# EAGLE design Validation (EAGLE 9.5.2)
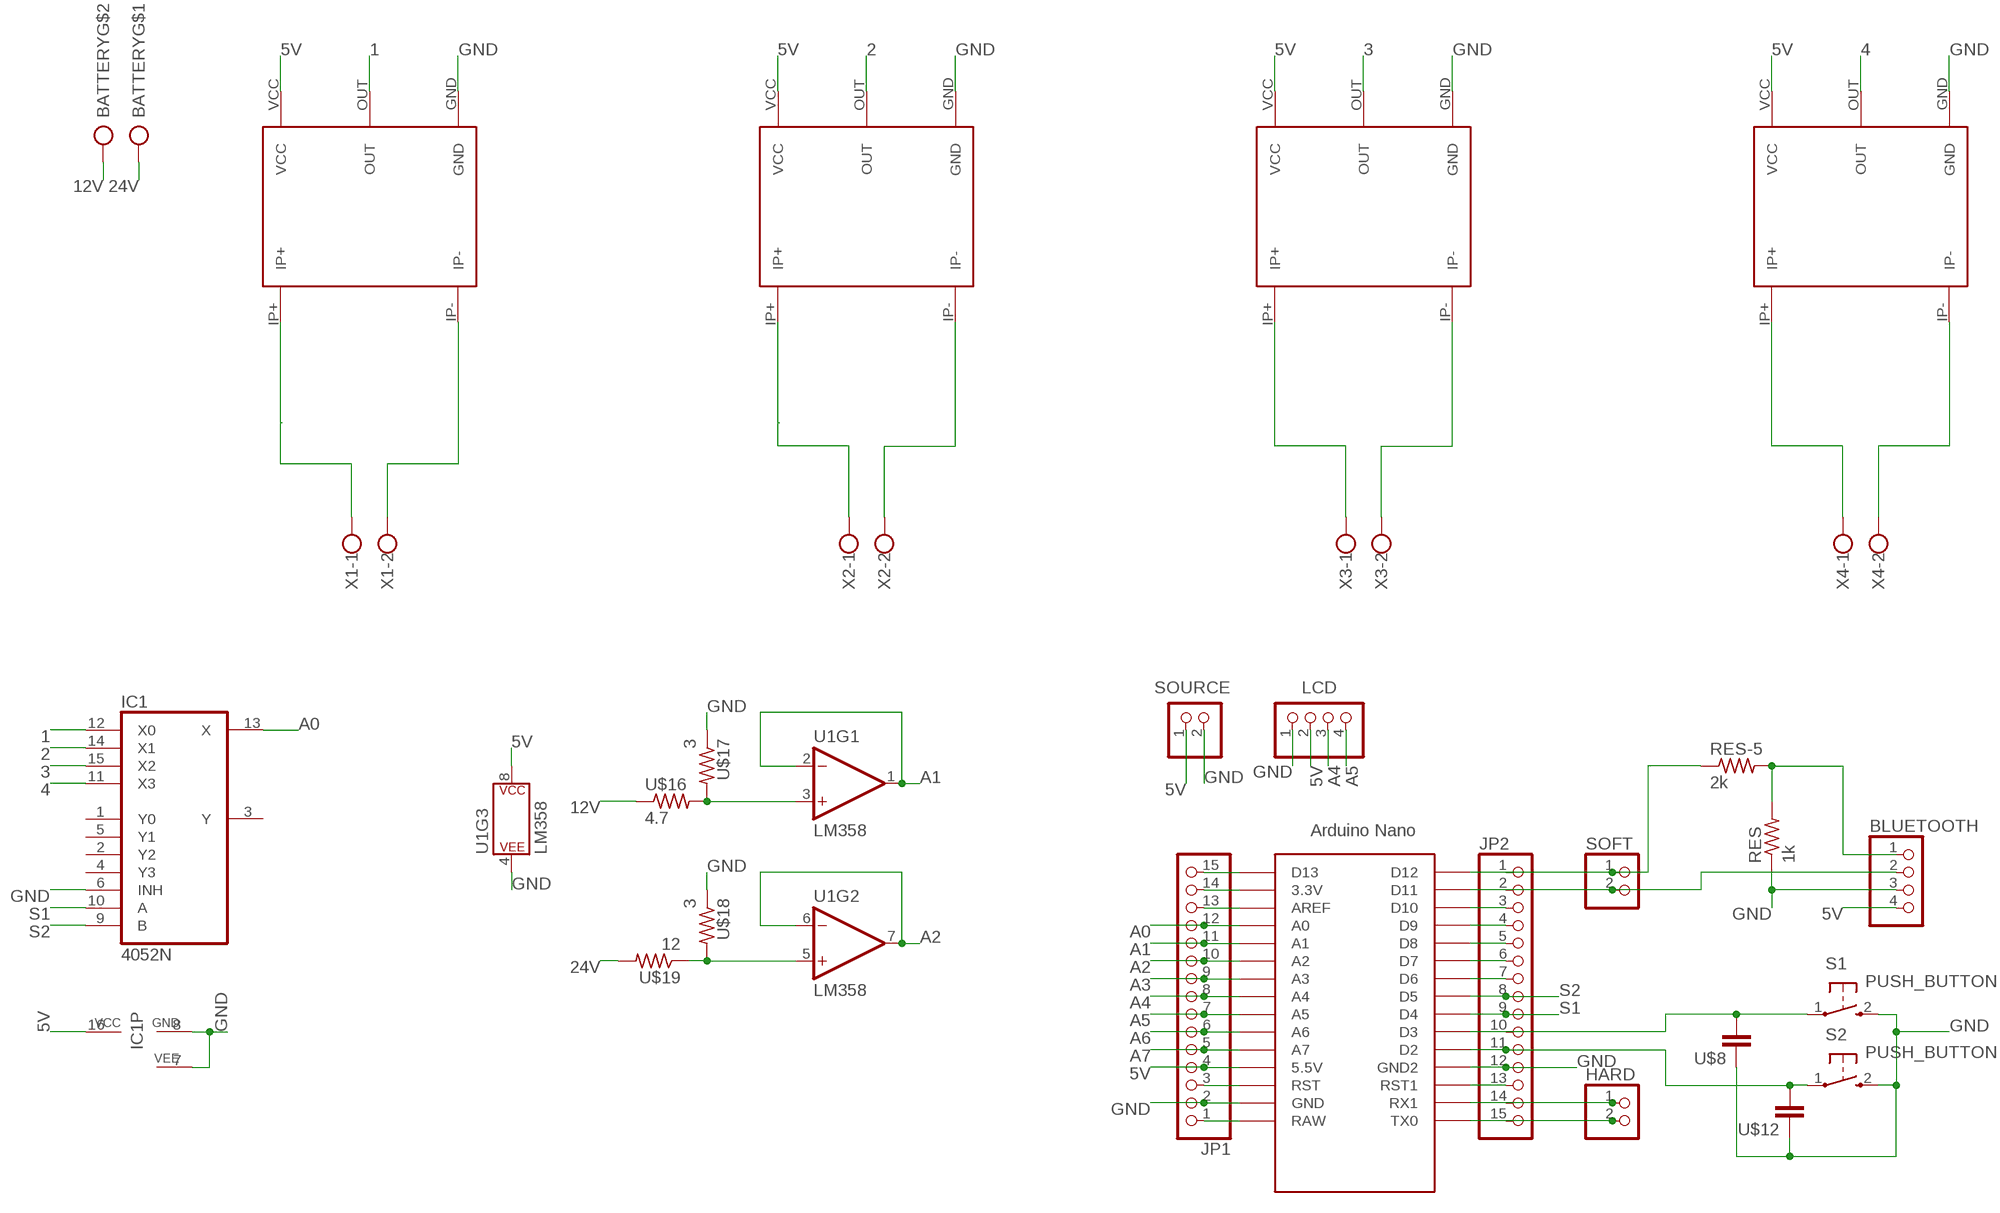
[diagram p0: schematic, sheet 1]

## Parts
BATTERY  CON_PTR_2  [AK300/2]
BLUETOOTH  PINHD-4_DATA  [1X04_DATA]
HARD  PINHD-2_DATA  [1X02_DATA]
IC1  4052N  [DIL16]
JP1  PINHD-1X15  [1X15]
JP2  PINHD-1X15  [1X15]
LCD  PINHD-4_DATA  [1X04_DATA]
RES  1k  RES-5  [0204/5]
RES-5  2k  RES-5  [0204/5]
S1  PUSH_BUTTON  [B3F-10XX]
S2  PUSH_BUTTON  [B3F-10XX]
SOFT  PINHD-2_DATA  [1X02_DATA]
SOURCE  PINHD-2_DATA  [1X02_DATA]
U1  LM358  [DIP08]
U$1  ASC712_MODULE  [ASC712_MODULE]
U$4  ARDUINO_NANO  [NANO]
U$5  ASC712_MODULE  [ASC712_MODULE]
U$8  CAPACITOR  [C025-025X050]
U$9  ASC712_MODULE  [ASC712_MODULE]
U$12  CAPACITOR  [C025-025X050]
U$13  ASC712_MODULE  [ASC712_MODULE]
U$16  4.7  RES-7  [0204/7]
U$17  3  RES-7  [0204/7]
U$18  3  RES-7  [0204/7]
U$19  12  RES-7  [0204/7]
X1  ROSTA.POWER  [W239-302]
X2  ROSTA.POWER  [W239-302]
X3  ROSTA.POWER  [W239-302]
X4  ROSTA.POWER  [W239-302]

## Nets
1: IC1.12(X0) U$1.OUT
2: IC1.14(X1) U$5.OUT
3: IC1.15(X2) U$9.OUT
4: IC1.11(X3) U$13.OUT
5V: BLUETOOTH.4 IC1.16(VCC) JP1.4 LCD.2 SOURCE.1 U1.8(P$V+) U$1.VCC U$4.5V(5.5V) U$5.VCC U$9.VCC U$13.VCC
12V: BATTERY.2 U$16.1
24V: BATTERY.1 U$19.2
A0: IC1.13(X) JP1.12 U$4.A0
A1: JP1.11 U1.1(OUT) U1.2(-IN) U$4.A1
A2: JP1.10 U1.6(-IN) U1.7(OUT) U$4.A2
A3: JP1.9 U$4.A3
A4: JP1.8 LCD.3 U$4.A4
A5: JP1.7 LCD.4 U$4.A5
A6: JP1.6 U$4.A6
A7: JP1.5 U$4.A7
GND: BLUETOOTH.3 IC1.6(INH) IC1.7(VEE) IC1.8(GND) JP1.2 JP2.12 LCD.1 RES.1 S1.2(S) S2.2(S) SOURCE.2 U1.4(P$V-) U$1.GND U$4.GND U$4.GND1(GND2) U$5.GND U$8.1 U$9.GND U$12.1 U$13.GND U$17.1 U$18.1
N$2: U$1.IP+ X1.1
N$3: JP1.1 U$4.RAW
N$4: U$1.IP- X1.2
N$6: U$5.IP+ X2.1
N$7: U$5.IP- X2.2
N$8: U$13.IP- X4.2
N$10: U$9.IP+ X3.1
N$11: U$9.IP- X3.2
N$12: U1.3(+IN) U$16.2 U$17.2
N$14: U$13.IP+ X4.1
N$15: JP1.3 U$4.RST
N$16: BLUETOOTH.1 RES-5.2 RES.2
N$21: U1.5(+IN) U$18.2 U$19.1
N$27: JP1.13 U$4.AREF
N$28: JP1.14 U$4.3.3V
N$29: JP1.15 U$4.D13
N$30: JP2.1 RES-5.1 SOFT.1 U$4.D12
N$31: BLUETOOTH.2 JP2.2 SOFT.2 U$4.D11
N$32: JP2.3 U$4.D10
N$33: JP2.4 U$4.D9
N$34: JP2.5 U$4.D8
N$35: JP2.6 U$4.D7
N$36: JP2.7 U$4.D6
N$39: JP2.10 S1.1(P) U$4.D3 U$8.2
N$40: JP2.11 S2.1(P) U$4.D2 U$12.2
N$42: JP2.13 U$4.RST1
N$43: HARD.1 JP2.14 U$4.RX1
N$44: HARD.2 JP2.15 U$4.TX0
S1: IC1.10(A) JP2.9 U$4.D4
S2: IC1.9(B) JP2.8 U$4.D5
Unconnected: IC1.1(Y0) IC1.2(Y2) IC1.3(Y) IC1.4(Y3) IC1.5(Y1)

## Library data of the parts
BATTERY = MIA_LIBRARY-2-2-2:CON_PTR_2
BLUETOOTH LCD = MIA_LIBRARY-2-2-2:PINHD-4_DATA: PIN HEADER
HARD SOFT SOURCE = MIA_LIBRARY-2-2-2:PINHD-2_DATA: PIN HEADER
IC1 = 40xx:4052: Dual 4-channel ANALOG MULTIPLEXER
JP1 JP2 = pinhead:PINHD-1X15: PIN HEADER
RES RES-5 = MIA_LIBRARY-2-2-2:RES-5
S1 S2 = MIA_LIBRARY-2-2-2:PUSH_BUTTON: OMRON SWITCH
U1 = MIA_LIBRARY-2-2-2:LM358: LM358 Jellybean op-amp Datasheet <http://www.sparkfun.com/datasheets/Components/General/LM358.pdf> SparkFun Products Op-Amp (Thru-Hole) - LM358 <https://www.sparkfun.com/products/9456> (COM-09456); PROD_ID: IC-09172
U$1 U$5 U$9 U$13 = MIA_LIBRARY-2-2-2:ASC712_MODULE
U$4 = MIA_LIBRARY-2-2-2:ARDUINO_NANO: Arduino Nano
U$8 U$12 = MIA_LIBRARY-2-2-2:CAPACITOR
U$16-U$19 = MIA_LIBRARY-2-2-2:RES-7
X1-X4 = MIA_LIBRARY-2-2-2:ROSTA.POWER: WAGO SCREW CLAMP; OC_FARNELL: unknown; OC_NEWARK: unknown

## Board
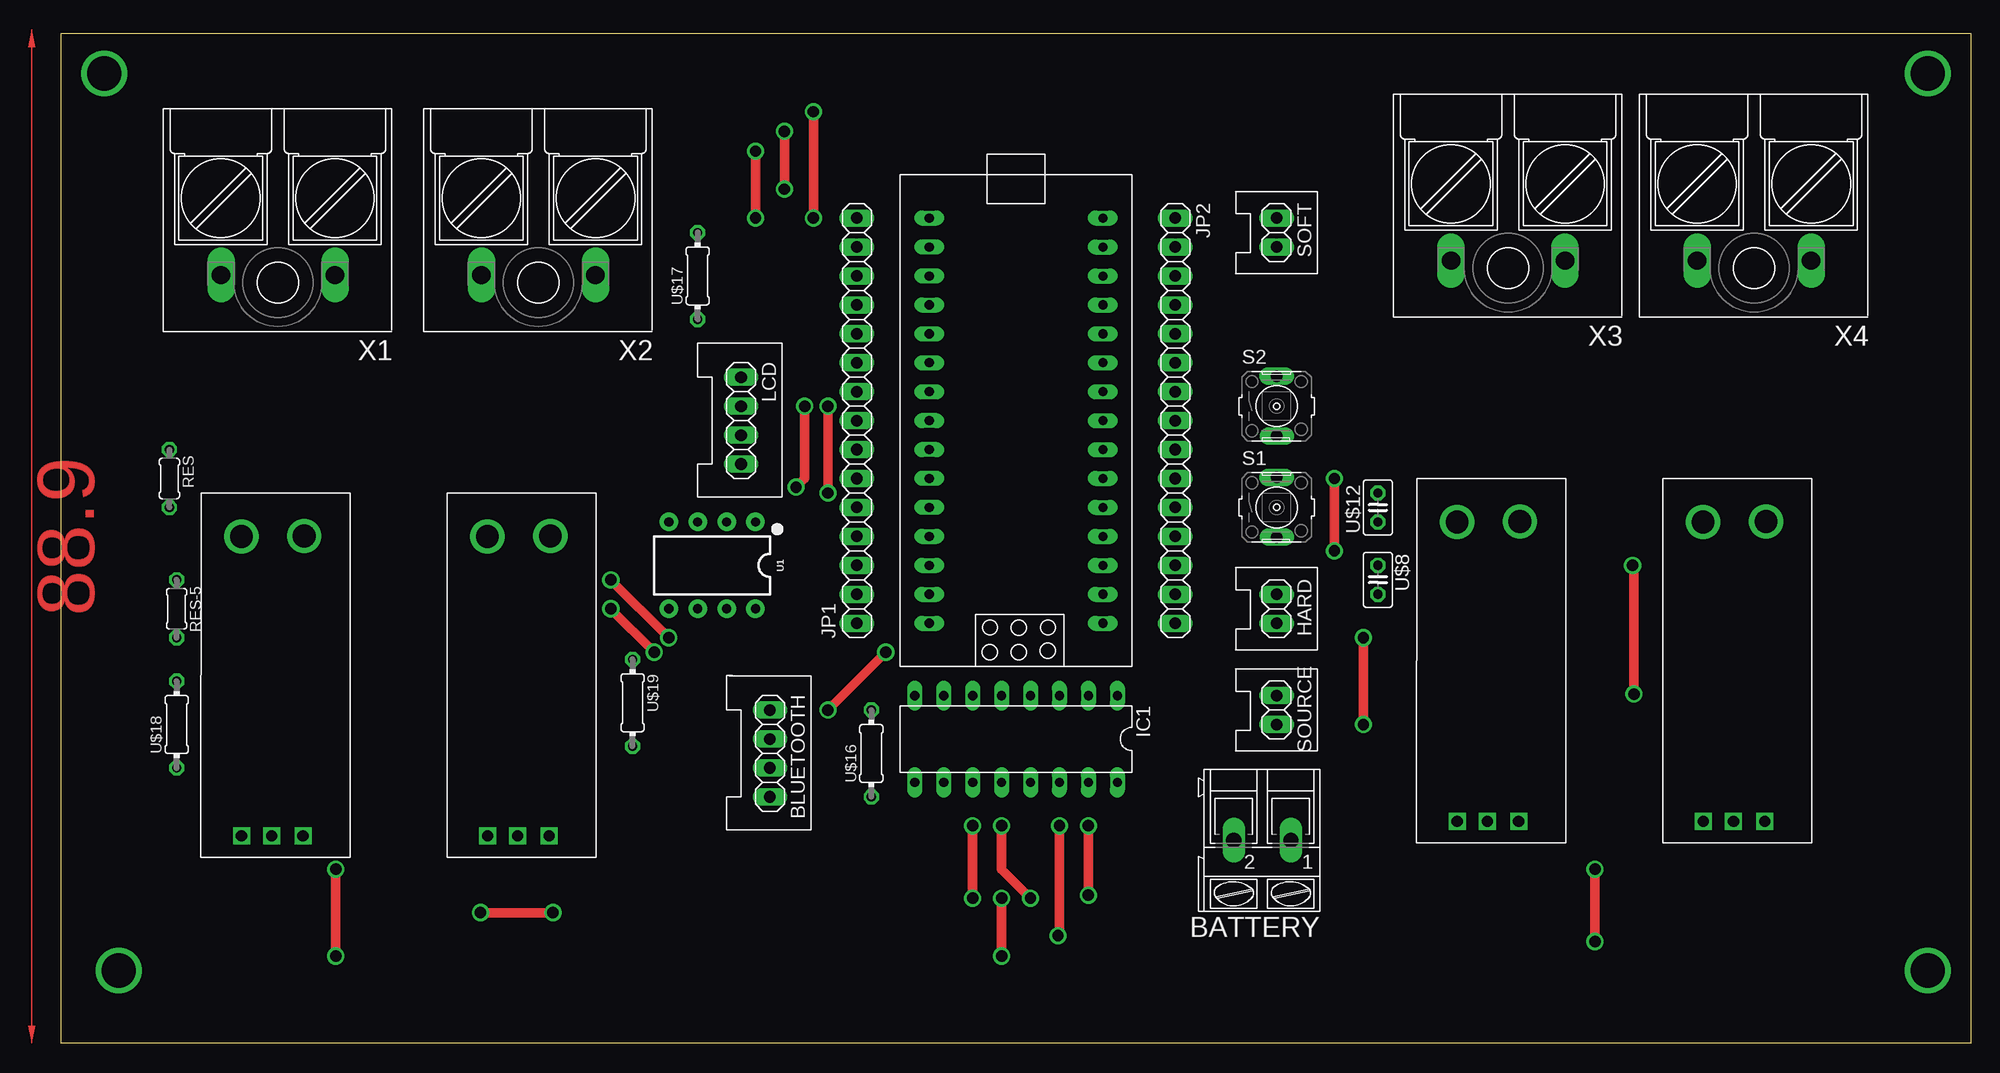
[diagram p1: board, top side]
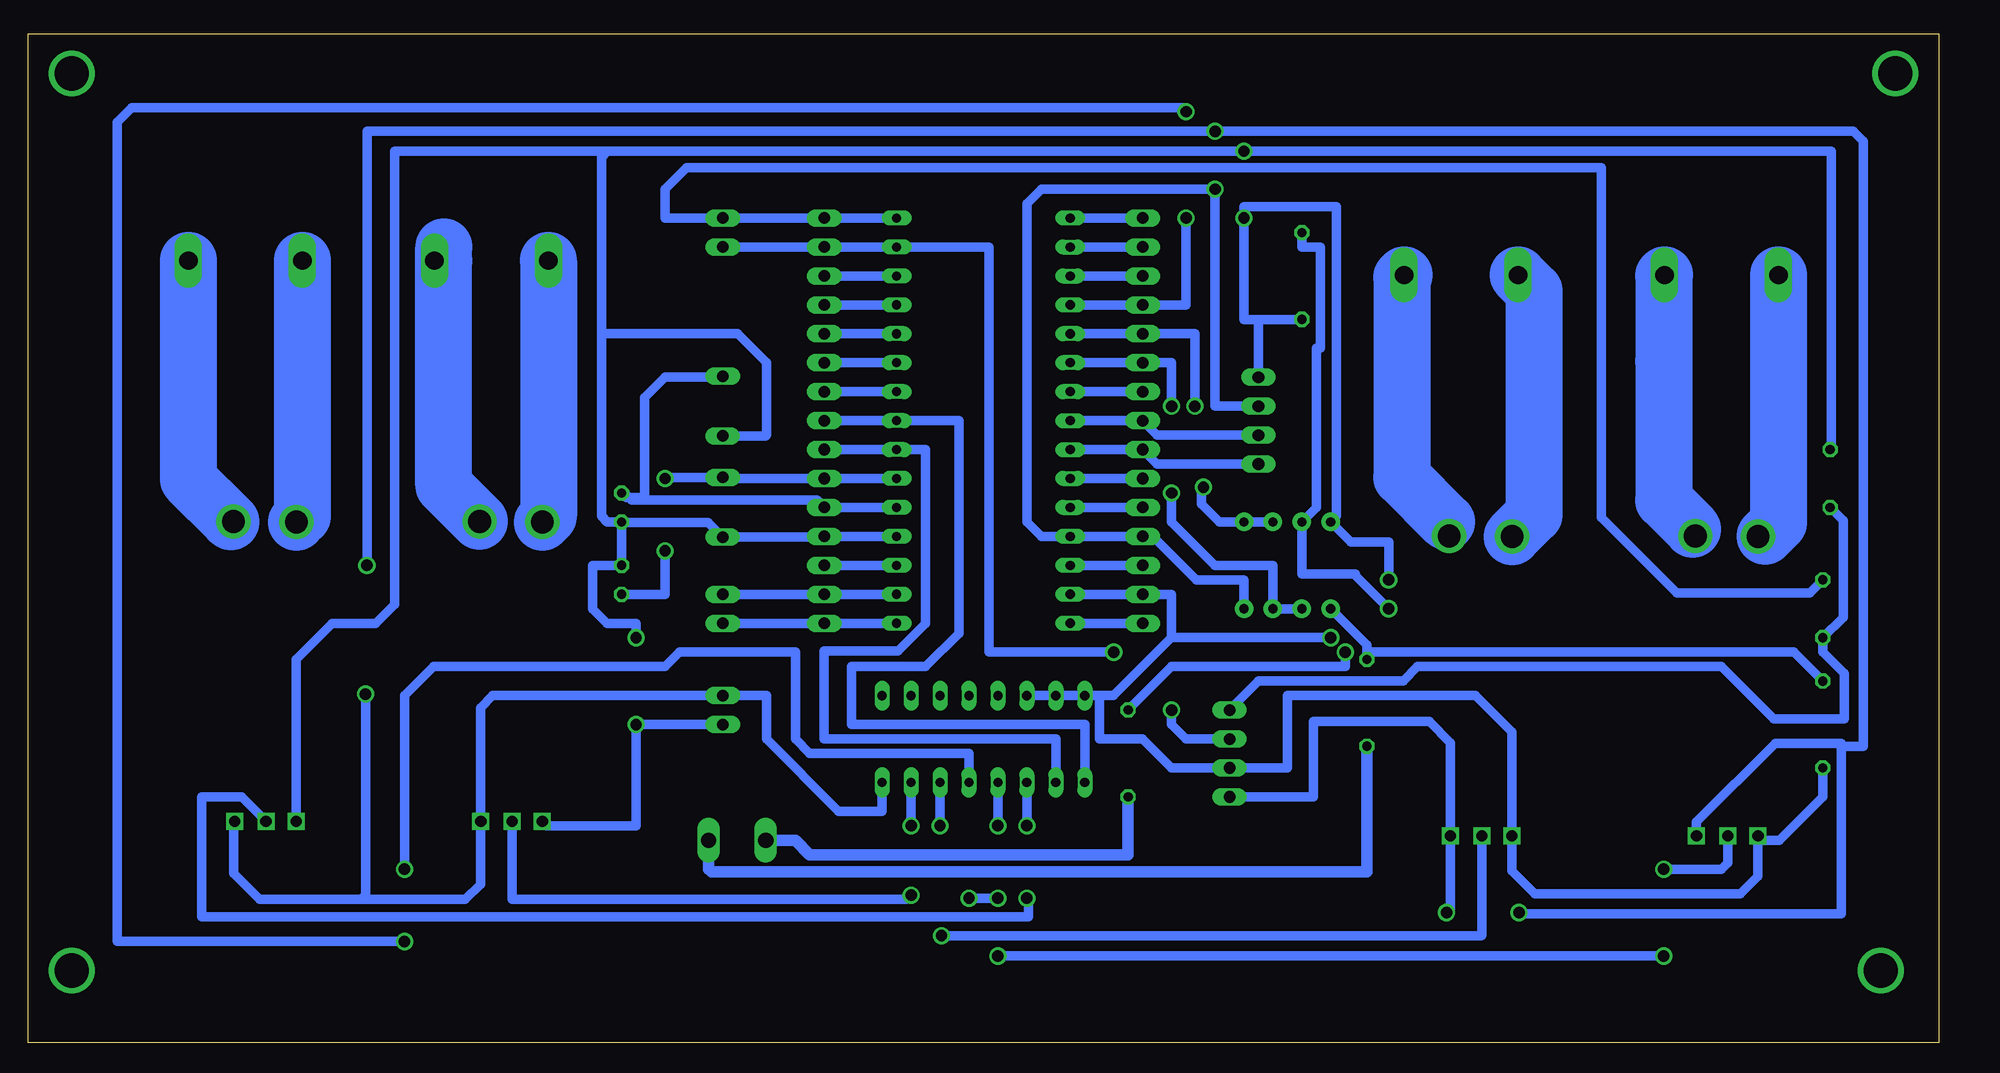
[diagram p2: board, bottom side, seen from below]

Size 167.62 x 88.57 mm. Coordinates in mm from the lower left corner, seen from the top.
Outline: 0,0 167.62,0 167.62,88.57 0,88.57 0,0
Copper layers (1*16): Top 0.035mm / dielectric 1.5mm / Bottom 0.035mm
Design rules "default": minimum track width 6mil, minimum drill 0.35mm, track to track 6mil, track to pad 6mil, pad to pad 6mil, via to via 6mil, smd to smd 6mil, copper to edge 40mil, drill to drill 6mil, minimum pad ring 10mil, minimum via ring 8mil, stop-mask expansion 4mil, vias tented up to drill 0mil, thermal gap 10mil

### Footprints (pad centres in the part's own frame; a part is rotated, then mirrored left to right if it is on the bottom)
AK300/2 = drill 1.321 long: 1 -2.515,0; 2 2.489,0
1X04_DATA = drill 1.016 long: 1 -3.81,0; 2 -1.27,0; 3 1.27,0; 4 3.81,0
1X02_DATA = drill 1.016 long: 1 -1.27,0; 2 1.27,0
DIL16 = drill 0.813 long: 1 -8.89,-3.81; 2 -6.35,-3.81; 3 -3.81,-3.81; 4 -1.27,-3.81; 5 1.27,-3.81; 6 3.81,-3.81; 7 6.35,-3.81; 8 8.89,-3.81; 9 8.89,3.81; 10 6.35,3.81; 11 3.81,3.81; 12 1.27,3.81; 13 -1.27,3.81; 14 -3.81,3.81; 15 -6.35,3.81; 16 -8.89,3.81
1X15 = drill 1.016 long: 1 -17.78,0; 2 -15.24,0; 3 -12.7,0; 4 -10.16,0; 5 -7.62,0; 6 -5.08,0; 7 -2.54,0; 8 0,0; 9 2.54,0; 10 5.08,0; 11 7.62,0; 12 10.16,0; 13 12.7,0; 14 15.24,0; 15 17.78,0
0204/5 = drill 0.813 octagon: 1 -2.54,0; 2 2.54,0
B3F-10XX = drill 1.016 long: 1 0.013,2.636; 2 0.029,-2.605
DIP08 = drill 0.813 pad 1.626: 1 -3.81,-3.81; 2 -1.27,-3.81; 3 1.27,-3.81; 4 3.81,-3.81; 5 3.81,3.81; 6 1.27,3.81; 7 -1.27,3.81; 8 -3.81,3.81
ASC712_MODULE = drill 1 square: GND 1.918,17.396; OUT -0.717,17.396; VCC -3.479,17.396 | drill 2: IP+ -3.579,-8.936; IP- 1.936,-8.871
NANO = drill 0.8 long: 3.3V -10.16,24.13; 5V -10.16,-1.27; A0 -10.16,19.05; A1 -10.16,16.51; A2 -10.16,13.97; A3 -10.16,11.43; A4 -10.16,8.89; A5 -10.16,6.35; A6 -10.16,3.81; A7 -10.16,1.27; AREF -10.16,21.59; D2 5.08,1.27; D3 5.08,3.81; D4 5.08,6.35; D5 5.08,8.89; D6 5.08,11.43; D7 5.08,13.97; D8 5.08,16.51; D9 5.08,19.05; D10 5.08,21.59; D11 5.08,24.13; D12 5.08,26.67; D13 -10.16,26.67; GND -10.16,-6.35; GND1 5.08,-1.27; RAW -10.16,-8.89; RST -10.16,-3.81; RST1 5.08,-3.81; RX1 5.08,-6.35; TX0 5.08,-8.89
C025-025X050 = drill 0.813 octagon: 1 -1.27,0; 2 1.27,0
0204/7 = drill 0.813 octagon: 1 -3.81,0; 2 3.81,0
W239-302 = drill 1.6 long: 1 -5,5; 2 5,5

### Placement (x,y rotation side)
BATTERY  105.41,17.78 180 top
BLUETOOTH  62.23,25.4 270 top
HARD  106.68,38.1 270 top
IC1  83.82,26.67 180 top
JP1  69.85,54.61 90 top
JP2  97.79,54.61 270 top
LCD  59.69,54.61 270 top
RES  9.53,49.53 270 top
RES-5  10.16,38.1 270 top
S1  106.68,46.99 0 top
S2  106.68,55.88 0 top
SOFT  106.68,71.12 270 top
SOURCE  106.68,29.21 270 top
U1  57.15,41.91 180 top
U$1  17.78,35.56 180 top
U$4  86.36,45.72 0 top
U$5  39.37,35.56 180 top
U$8  115.57,40.64 270 top
U$9  124.46,36.83 180 top
U$12  115.57,46.99 90 top
U$13  146.05,36.83 180 top
U$16  71.12,25.4 90 top
U$17  55.88,67.31 90 top
U$18  10.16,27.94 90 top
U$19  50.17,29.84 270 top
X1  19.05,72.39 180 top
X2  41.91,72.39 180 top
X3  127,73.66 180 top
X4  148.59,73.66 180 top

### Tracks (layer width: path | path; a pad name or v marks a point on that pad's centre or on a via)
1  (via drill 1 pad 1.3)
  Top 0.813: v24.13,15.24 v24.13,7.62 | v82.55,7.62 v82.55,12.7 | v85.09,12.7 82.55,15.24 v82.55,19.05
  Bottom 0.813: U$1.OUT 18.5,15.79 19.05,15.24 v24.13,15.24 | v24.13,7.62 v82.55,7.62 | v82.55,12.7 v85.09,12.7 | v82.55,19.05 IC1.12
2  (via drill 0.8, 1 pad 1.3)
  Top 0.813: v87.63,19.05 87.63,9.52 v87.5,9.4
  Bottom 0.813: IC1.14 v87.63,19.05 | U$5.OUT 40.09,9.44 40.13,9.4 v87.5,9.4 87.76,9.4
3  (via drill 0.8, 1 pad 1.3)
  Top 0.813: v90.17,12.95 v90.17,19.05
  Bottom 0.813: U$9.OUT 125.18,12.57 90.55,12.57 v90.17,12.95 89.92,12.95 | IC1.15 v90.17,19.05
4  (via drill 0.8, 1 pad 1.3)
  Top 0.813: v80.01,19.05 v80.01,12.7
  Bottom 0.813: U$13.OUT 148.92,21.59 152.4,21.59 152.4,11.05 79.88,11.05 79.88,12.57 v80.01,12.7 | IC1.11 v80.01,19.05
5V  (via drill 1 pad 1.3)
  Top 0.813: v36.83,11.43 v43.18,11.43 | v63.5,74.93 v63.5,80.01 | v137.92,41.91 138.05,41.91 v138.05,30.61
  Bottom 0.813: U1.8 60.96,40.64 65.15,40.64 68.96,44.45 JP1.4 U$4.5V 78.74,44.45 80.01,45.72 80.01,73.66 78.74,74.93 v63.5,74.93 63.5,55.88 LCD.2 | U$1.VCC 21.26,19.38 14.35,26.29 8.53,26.29 | BLUETOOTH.4 54.86,21.59 54.86,28.19 44.7,28.19 42.85,26.34 U$5.VCC 42.85,11.76 v43.18,11.43 | 8.53,26.29 8.53,11.3 36.83,11.3 v36.83,11.43 | U$9.VCC 127.94,29.41 126.87,30.48 SOURCE.1 102.87,30.48 102.87,26.67 96.52,20.32 92.71,20.32 IC1.16 | U$9.VCC 127.94,13.92 129.29,12.57 138.43,12.57 | 138.43,12.57 147.32,12.57 149.61,14.86 149.61,19.36 U$13.VCC | 8.53,26.29 8.28,26.04 6.6,26.04 6.6,79.12 7.49,80.01 v63.5,80.01 137.92,80.01 v137.92,41.91 | 128.07,19.3 U$9.VCC | 138.43,12.57 138.05,12.95 v138.05,30.61
12V
  Bottom 1.016: U$16.1 71.12,16.51 99.06,16.51 100.33,17.78 BATTERY.2
24V
  Bottom 1.016: U$19.2 50.17,14.99 107.7,14.99 107.95,15.24 107.95,17.76 BATTERY.1
A0  (via drill 1)
  Top 0.813: v134.62,15.24 v134.62,8.89 | v66.04,81.72 v66.04,72.39
  Bottom 0.813: U$4.A0 JP1.12 66.04,64.77 v66.04,72.39 | IC1.13 85.09,25.4 99.06,25.4 100.33,26.67 100.33,34.29 110.49,34.29 111.76,33.02 132.08,33.02 134.62,30.48 v134.62,15.24 | v134.62,8.89 159.85,8.89 159.85,80.8 158.58,82.07 66.04,82.07 v66.04,81.72
A1  (via drill 1 pad 1.3)
  Top 0.813: v65.28,55.88 65.28,49.53 v64.52,48.77
  Bottom 0.813: U$4.A1 JP1.11 65.28,62.23 v65.28,55.88 | U1.2 U1.1 63.12,45.72 64.71,47.31 64.71,48.58 v64.52,48.77
A2  (via drill 1 pad 1.3)
  Top 0.813: v67.31,55.88 v67.31,48.26
  Bottom 0.813: U$4.A2 JP1.10 67.31,59.69 v67.31,55.88 | U1.6 U1.7 58.42,41.91 63.5,41.91 67.31,45.72 v67.31,48.26
A3
  Bottom 0.813: JP1.9 U$4.A3
A4
  Bottom 0.813: U$4.A4 JP1.8 68.58,53.34 LCD.3
A5
  Bottom 0.813: U$4.A5 JP1.7 68.58,50.8 LCD.4
A6
  Bottom 0.813: JP1.6 U$4.A6
A7
  Bottom 0.813: JP1.5 U$4.A7
GND  (via drill 1, 1 pad 1.3)
  Top 0.813: v114.3,35.56 v114.3,27.94 | v60.96,72.39 v60.96,78.26 | v53.34,35.56 v48.26,40.64
  Bottom 0.813: U$4.GND1 JP2.12 97.85,44.39 S1.2 | U$4.GND JP1.2 67.31,39.37 67.31,35.56 | RES.1 9.42,52.17 9.42,78.26 v60.96,78.26 116.84,78.26 | U$12.1 U$8.1 118.11,41.91 118.11,38.1 116.84,36.83 114.3,36.83 v114.3,35.56 | U$12.1 115.5,45.66 107.98,45.66 S1.2 | U$18.1 10.16,21.59 13.97,17.78 15.48,17.78 U$1.GND 15.86,14.62 17.4,13.08 35.43,13.08 37.47,15.11 37.47,18.15 U$5.GND 37.45,27.29 40.64,30.48 57.15,30.48 57.15,24.13 BLUETOOTH.3 67.31,24.13 69.85,26.67 73.66,26.67 73.66,30.48 | S2.2 102.94,53.28 102.87,53.34 102.87,59.69 105.41,62.23 117.35,62.23 | LCD.1 59.69,63.5 | 59.69,63.5 60.96,63.5 v60.96,72.39 60.96,73.41 52.83,73.41 52.83,46.23 U1.4 51.56,43.94 48.26,43.94 v48.26,40.64 | 59.69,63.5 U$17.1 | IC1.6 IC1.7 IC1.8 73.66,30.48 | 116.84,78.26 135.51,78.26 135.51,38.48 137.16,36.83 140.97,36.83 144.13,33.67 U$13.GND | 73.66,30.48 72.39,30.48 67.31,35.56 | 106.68,44.36 S1.2 | U$9.GND 122.16,19.05 114.3,19.05 v114.3,27.94 SOURCE.2 | 67.31,35.56 v53.34,35.56 | 116.84,78.26 117.35,77.75 117.35,62.23 | U$12.1 116.84,45.72 117.35,46.23 117.35,62.23
N$2
  Bottom 0.152: U$1.IP+ 21.77,44.64 21.59,45.1
  Bottom 2.54: 24.05,59.72 24.13,59.8
  Bottom 5: 21.59,45.1 24.13,47.64 24.13,59.8 24.13,67.31 X1.1
N$3
  Bottom 0.813: U$4.RAW JP1.1
N$4
  Bottom 0.152: U$1.IP- 16.27,44.64 15.24,44.45
  Bottom 5: X1.2 14.05,45.64 15.24,44.45
N$6
  Bottom 0.152: U$5.IP+ 43.27,44.64 43.18,45.72
  Bottom 5: X2.1 47.11,67.19 47.11,49.65 43.18,45.72
N$7
  Bottom 5: X2.2 35.51,65.99 35.51,46.35 U$5.IP-
N$8
  Bottom 5: X4.2 143.59,46.22 U$13.IP-
N$10
  Bottom 0.152: X3.1 132.27,68.64 131.18,68.64
  Bottom 0.813: 128.08,45.72 U$9.IP+
  Bottom 5: U$9.IP+ 131.18,48.91 131.18,68.64 131.18,69.85
N$11
  Bottom 5: X3.2 122,46.22 U$9.IP-
N$12  (via drill 1 pad 1.3)
  Top 0.813: v52.07,34.29 v48.26,38.1
  Bottom 0.813: U$17.2 55.88,69.85 54.23,69.85 54.23,60.96 54.61,60.96 54.61,46.99 U1.3 55.88,41.15 51.18,41.15 51.23,41.07 v48.26,38.1 | U$16.2 67.31,33.02 52.07,33.02 v52.07,34.29
N$14
  Bottom 0.152: U$13.IP+ 149.77,46.14 150.03,45.89
  Bottom 5: X4.1 153.59,49.45 150.03,45.89 149.86,45.72
N$15
  Bottom 0.813: JP1.3 U$4.RST
N$16
  Bottom 0.813: RES.2 8.38,45.85 8.38,37.34 RES-5.2 10.16,34.29 8.28,32.41 8.28,28.45 14.48,28.45 19.05,33.02 45.72,33.02 46.99,31.75 59.69,31.75 BLUETOOTH.1
N$21
  Bottom 0.813: U1.5 50.17,34.92 50.17,34.29 | 50.17,34.29 U$19.1 | U$18.2 12.7,34.29 50.17,34.29
N$27
  Bottom 0.813: JP1.13 U$4.AREF
N$28
  Bottom 0.813: JP1.14 U$4.3.3V
N$29
  Bottom 0.813: JP1.15 U$4.D13
N$30
  Bottom 0.813: RES-5.1 11.3,39.5 22.99,39.5 29.59,46.1 29.59,76.83 109.85,76.83 111.76,74.93 111.76,72.39 SOFT.1 JP2.1 U$4.D12 91.57,72.52
N$31  (via drill 1 pad 1.3)
  Top 0.813: v67.31,29.21 v72.39,34.29
  Bottom 0.813: SOFT.2 JP2.2 U$4.D11 83.31,69.85 83.31,34.29 v72.39,34.29 | BLUETOOTH.2 66.04,26.67 67.31,27.94 v67.31,29.21
N$32
  Bottom 0.813: JP2.3 U$4.D10
N$33
  Bottom 0.813: JP2.4 U$4.D9
N$34
  Bottom 0.813: U$4.D8 JP2.5
N$35
  Bottom 0.813: JP2.6 U$4.D7
N$36
  Bottom 0.813: U$4.D6 JP2.7
N$39  (via drill 1 pad 1.3)
  Top 0.813: v111.76,49.53 v111.76,43.18
  Bottom 0.813: U$4.D3 JP2.10 106.6,49.53 S1.1 111.66,49.63 v111.76,49.53 | U$8.2 111.76,39.37 v111.76,43.18
N$40
  Bottom 0.813: U$4.D2 JP2.11 98.42,47.62 114.68,47.62 115.32,48.26 U$12.2 115.19,47.88 113.54,47.88 113.54,56.64 111.76,58.42 106.79,58.42 S2.1
N$42
  Bottom 0.813: U$4.RST1 JP2.13
N$43
  Bottom 0.813: U$4.RX1 JP2.14 HARD.1
N$44
  Bottom 0.813: U$4.TX0 JP2.15 HARD.2
S1
  Bottom 0.813: JP2.9 U$4.D4 88.9,52.07 88.9,36.83 91.31,34.42 97.79,34.42 97.79,26.67 77.47,26.67 IC1.10
S2
  Bottom 0.813: JP2.8 U$4.D5 85.98,54.61 85.98,35.94 88.9,33.02 95.38,33.02 95.38,27.94 74.93,27.94 IC1.9
S$1  (via drill 3)
  other vias: 3.81,85.09
S$2  (via drill 3)
  other vias: 5.08,6.35
S$3  (via drill 3)
  other vias: 163.83,6.35
S$4  (via drill 3)
  other vias: 163.83,85.09
(copper drawn outside any net)
  shapes: Top area x2